# EAGLE design mainboard (EAGLE 9.6.2)
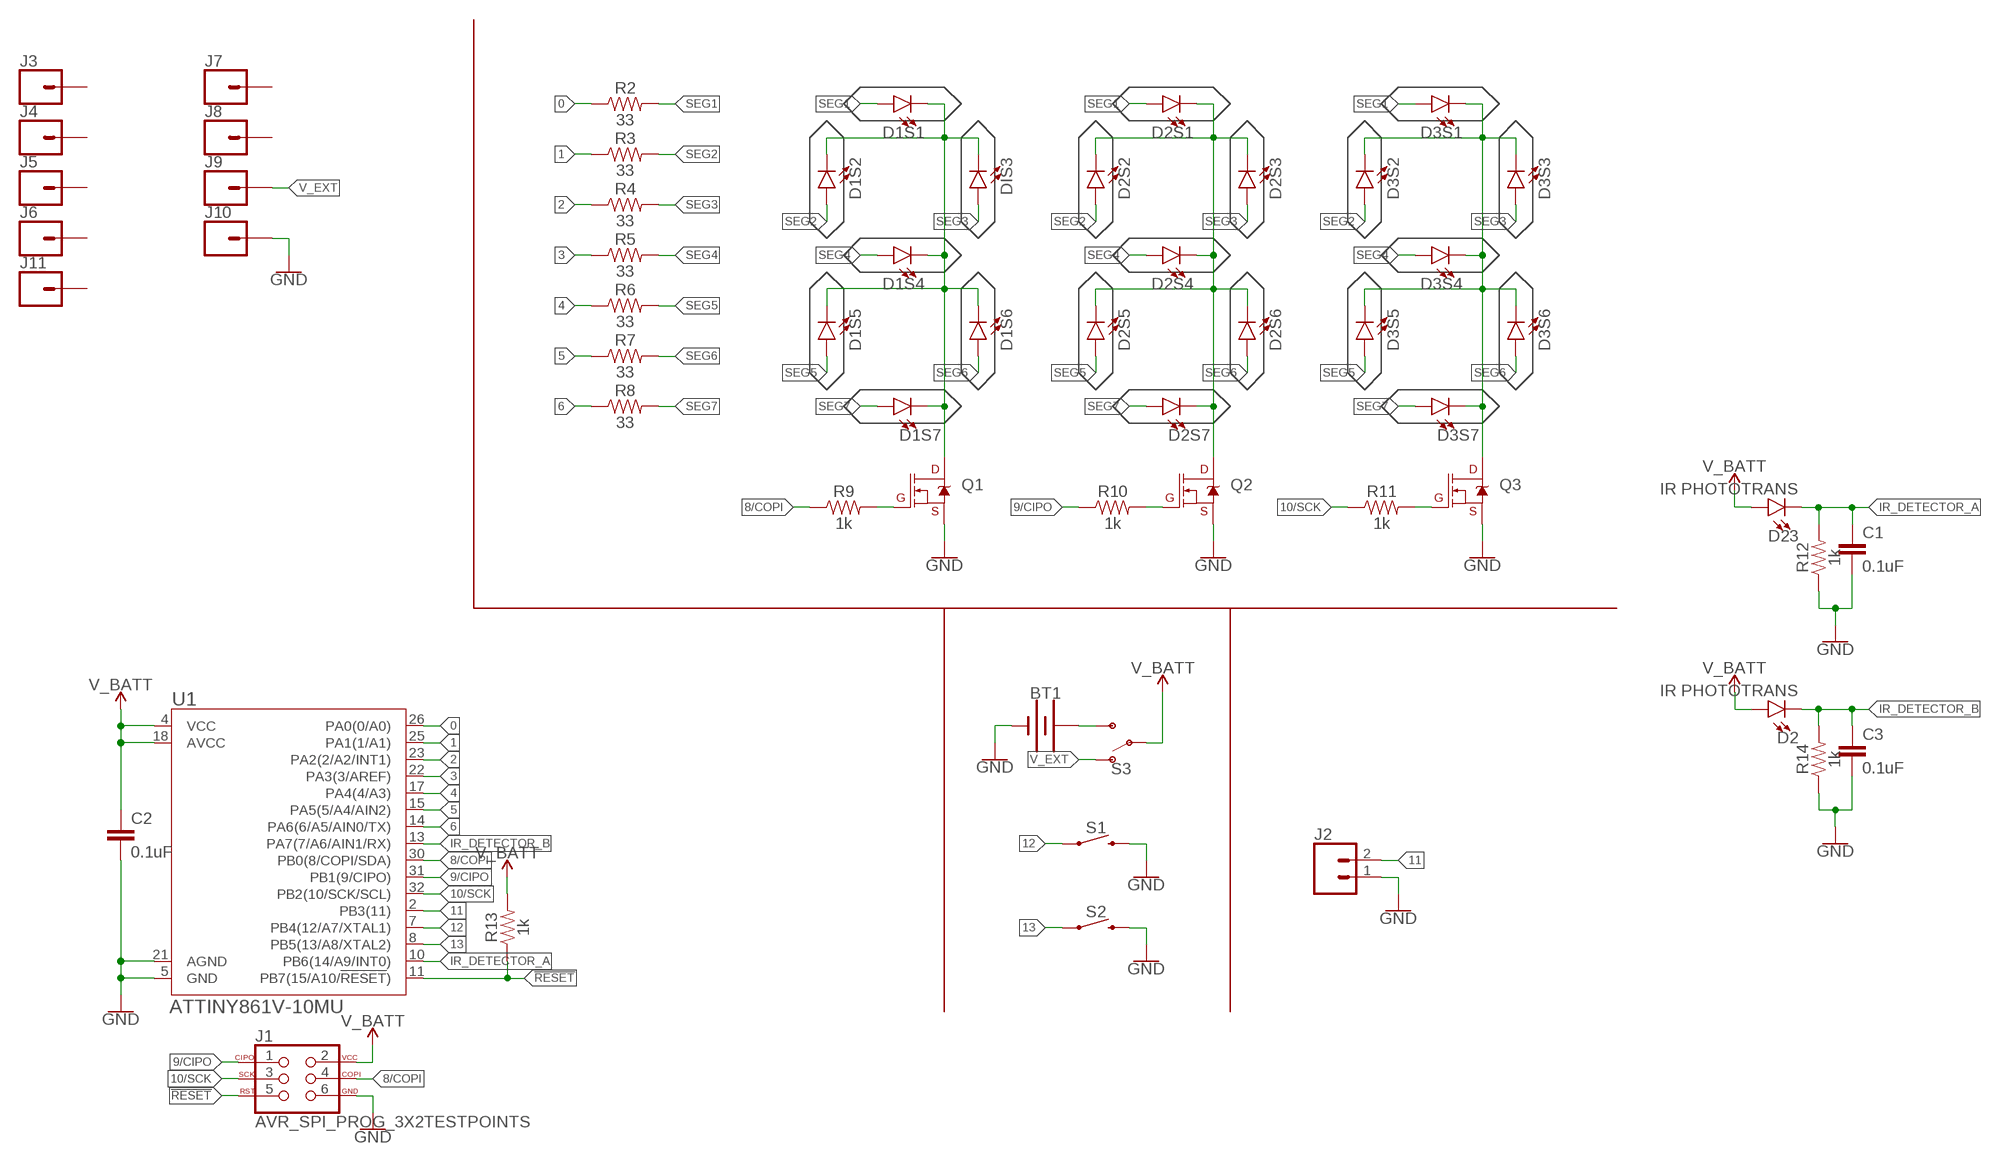
[diagram p0: schematic, sheet 1]

## Parts
BT1  BATTERY-20MM_SMD_4LEGS_OVERPASTE_INNER  [BATTCON_20MM_4LEGS_OVERPASTE_INNER]
C1  0.1uF  0.1UF-0603-25V-(+80/-20%)  [0603]
C2  0.1uF  0.1UF-0603-25V-(+80/-20%)  [0603]
C3  0.1uF  0.1UF-0603-25V-(+80/-20%)  [0603]
D1S1  LED0603  [LED-0603]
D1S2  LED0603  [LED-0603]
D1S4  LED0603  [LED-0603]
D1S5  LED0603  [LED-0603]
D1S6  LED0603  [LED-0603]
D1S7  LED0603  [LED-0603]
D2  IR PHOTOTRANS  LED-IR0603  [LED-0603]
D2S1  LED0603  [LED-0603]
D2S2  LED0603  [LED-0603]
D2S3  LED0603  [LED-0603]
D2S4  LED0603  [LED-0603]
D2S5  LED0603  [LED-0603]
D2S6  LED0603  [LED-0603]
D2S7  LED0603  [LED-0603]
D3S1  LED0603  [LED-0603]
D3S2  LED0603  [LED-0603]
D3S3  LED0603  [LED-0603]
D3S4  LED0603  [LED-0603]
D3S5  LED0603  [LED-0603]
D3S6  LED0603  [LED-0603]
D3S7  LED0603  [LED-0603]
D23  IR PHOTOTRANS  LED-IR0603  [LED-0603]
DIS3  LED0603  [LED-0603]
J1  AVR_SPI_PROG_3X2TESTPOINTS  [2X3_TEST_POINTS]
J2  CONN_02  [1X02]
J3  CONN_01  [1X01]
J4  CONN_01  [1X01]
J5  CONN_01  [1X01]
J6  CONN_01  [1X01]
J7  CONN_01  [1X01]
J8  CONN_01  [1X01]
J9  CONN_01  [1X01]
J10  CONN_01  [1X01]
J11  CONN_01  [1X01]
Q1  220mA/50V/3.5Ω  MOSFET-NCH-BSS138  [SOT23-3]
Q2  220mA/50V/3.5Ω  MOSFET-NCH-BSS138  [SOT23-3]
Q3  220mA/50V/3.5Ω  MOSFET-NCH-BSS138  [SOT23-3]
R2  33  33OHM-0603-1/10W-1%  [0603]
R3  33  33OHM-0603-1/10W-1%  [0603]
R4  33  33OHM-0603-1/10W-1%  [0603]
R5  33  33OHM-0603-1/10W-1%  [0603]
R6  33  33OHM-0603-1/10W-1%  [0603]
R7  33  33OHM-0603-1/10W-1%  [0603]
R8  33  33OHM-0603-1/10W-1%  [0603]
R9  1k  1KOHM-0603-1/10W-1%  [0603]
R10  1k  1KOHM-0603-1/10W-1%  [0603]
R11  1k  1KOHM-0603-1/10W-1%  [0603]
R12  1k  1KOHM-0603-1/10W-1%  [0603]
R13  1k  1KOHM-0603-1/10W-1%  [0603]
R14  1k  1KOHM-0603-1/10W-1%  [0603]
S1  MOMENTARY-SWITCH-SPST-SMD-5.2MM-TALL  [TACTILE_SWITCH_SMD_5.2MM]
S2  MOMENTARY-SWITCH-SPST-SMD-5.2MM-TALL  [TACTILE_SWITCH_SMD_5.2MM]
S3  SWITCH-SPDT-SMD-RIGHT-ANGLE  [SWITCH_SPST_SMD_A]
U1  ATTINY861V-10MU  [32M1-A_ATM]

## Nets
0: R2.1 U1.26(PA0(0/A0))
1: R3.1 U1.25(PA1(1/A1))
2: R4.1 U1.23(PA2(2/A2/INT1))
3: R5.1 U1.22(PA3(3/AREF))
4: R6.1 U1.17(PA4(4/A3))
5: R7.1 U1.15(PA5(5/A4/AIN2))
6: R8.1 U1.14(PA6(6/A5/AIN0/TX))
8/COPI: J1.4 R9.1 U1.30(PB0(8/COPI/SDA))
9/CIPO: J1.1 R10.1 U1.31(PB1(9/CIPO))
10/SCK: J1.3 R11.1 U1.32(PB2(10/SCK/SCL))
11: J2.2 U1.2(PB3(11))
12: S1.1 U1.7(PB4(12/A7/XTAL1))
13: S2.1 U1.8(PB5(13/A8/XTAL2))
!RESET: J1.5 R13.1 U1.11(PB7(15/A10/!RESET!))
GND: BT1.2(-) C1.2 C2.2 C3.2 J1.6 J2.1 J10.1 Q1.2(S) Q2.2(S) Q3.2(S) R12.1 R14.1 S1.3 S2.3 U1.5(GND) U1.21(AGND)
IR_DETECTOR_A: C1.1 D23.C R12.2 U1.10(PB6(14/A9/INT0))
IR_DETECTOR_B: C3.1 D2.C R14.2 U1.13(PA7(7/A6/AIN1/RX))
N$1: BT1.1(+) S3.3(S)
N$4: D1S1.C D1S2.C D1S4.C D1S5.C D1S6.C D1S7.C DIS3.C Q1.3(D)
N$8: Q2.1(G) R10.2
N$9: Q1.1(G) R9.2
N$11: D2S1.C D2S2.C D2S3.C D2S4.C D2S5.C D2S6.C D2S7.C Q2.3(D)
N$13: Q3.1(G) R11.2
N$14: D3S1.C D3S2.C D3S3.C D3S4.C D3S5.C D3S6.C D3S7.C Q3.3(D)
SEG1: D1S1.A D2S1.A D3S1.A R2.2
SEG2: D1S2.A D2S2.A D3S2.A R3.2
SEG3: D2S3.A D3S3.A DIS3.A R4.2
SEG4: D1S4.A D2S4.A D3S4.A R5.2
SEG5: D1S5.A D2S5.A D3S5.A R6.2
SEG6: D1S6.A D2S6.A D3S6.A R7.2
SEG7: D1S7.A D2S7.A D3S7.A R8.2
V_BATT: C2.1 D2.A D23.A J1.2 R13.2 S3.2(P) U1.4(VCC) U1.18(AVCC)
V_EXT: J9.1 S3.1(O)
Unconnected: J3.1 J4.1 J5.1 J6.1 J7.1 J8.1 J11.1

## Library data of the parts
BT1 = SparkFun-Batteries:BATTERY: Battery - Single Cell A variety of battery chemistries, sizes, and footprints. Device List: 20MM_PTH - Coin Cell Battery Holder - 20mm (PTH) <https://www.sparkfun.com/products/783> 20MM_PTH_KIT- Coin Cell battery Holder - 20 mm (PTH) <http://www.sparkfun.com/products/783>kit version with special mask 6.8MM_PTH - Coin Cell Battery Holder - 6.8MM(SMD) <https://www.digikey.com/product-detail/en/seiko-instruments/MS621FE-FL11E/728-1057-ND/1889208?WT.srch=1&gclid=CNOQ5a6LzdQCFZS2wAodXCkE0g> 12MM_SMD - Coin Cell Battery Holder - 12mm (SMD) <https://www.sparkfun.com/products/10592> 12MM_PTH - Coin Cell Battery Holder - 12mm (PTH) <https://www.sparkfun.com/products/7948> 20MM_SMD - 20mm Coin Cell Battery Holder (SMD) (2 legs) Used on the Big Time Watch Kit <https://www.sparkfun.com/products/11734> 20MM_SMD_4LEGS - Coin Cell Battery Holder - 20mm (SMD) <https://www.sparkfun.com/products/11892> 20MM_SMD_4LEGS_OVERPASTE - Coin Cell Battery Holder - 20mm (SMD) <https://www.sparkfun.com/products/11892> (Over-paste on the legs) 24.5MM_PTH - Coin Cell Battery Holder - 24.5mm (PTH) <https://www.sparkfun.com/products/8863> 9V - 9V Battery Holder - PC Mount Used on the SparkFun SparkPunk Sound Kit <https://www.sparkfun.com/products/11177> and SparkFun SparkPunk Sequencer Kit <https://www.sparkfun.com/products/12707> 18650 - Battery Holder - 18650 (PTH) <https://www.sparkfun.com/products/13113> AA - Battery Holder - 1xAA (PTH) <https://www.sparkfun.com/products/7949> AAA - Battery Holder - 1xAAA (PTH) <https://www.sparkfun.com/products/12718> AA_KIT - Battery Holder - 1xAA (PTH) <https://www.sparkfun.com/products/7949> Special kit package - pads only have exposed copper on one side of the board. AAA_KIT - Battery Holder - 1xAAA (PTH) <https://www.sparkfun.com/products/12718> Special kit package - pads only have exposed copper on one side of the board.
C1-C3 = SparkFun-Capacitors:0.1UF: 0.1µF ceramic capacitors A capacitor is a passive two-terminal electrical component used to store electrical energy temporarily in an electric field.; PROD_ID: CAP-00810
D1S1 D1S2 D1S4-D1S7 D2S1-D2S7 D3S1-D3S7 DIS3 = SparkFun-LED:LED: LED (Generic) Standard schematic elements and footprints for 5mm, 3mm, 1206, and 0603 sized LEDs. Generic LEDs with no color specified.
D2 D23 = SparkFun-LED:LED-IR: Infrared LED (IR) Wavelength: 940nm Packages: TSAL6100 LTE302 - Side firing. Check SparkFun-Sensors.lbr for the receiver SparkFun Products: ZX Distance and Gesture Sensor <[https://www.sparkfun.com/products/12780]> Infrared Emitters and Detectors <https://www.sparkfun.com/products/241>; PROD_ID: DIO-14125
J1 = SparkFun-Connectors:AVR_SPI_PROG_3X2: AVR ISP 6 Pin This is the reduced ISP connector for AVR programming. Common on Arduino. This footprint will take up less PCB space and can be used with a 10-pin to 6-pin adapter such as SKU: BOB-08508 **Special note about "TEST_POINT" package. The stop mask is on the top side, so if you want your programming test points to be on the bottom of your board, make sure to place this package on the bottom side of the board. This also ensure that the orientation to program from the bottom side will be correct. SparkFun Products: SparkFun ISP Pogo Adapter <https://www.sparkfun.com/products/11591> - NS Tiny AVR Programmer <https://www.sparkfun.com/products/11801> -PTH
J2 = SparkFun-Connectors:CONN_02: Multi connection point. Often used as Generic Header-pin footprint for 0.1 inch spaced/style header connections On any of the 0.1 inch spaced packages, you can populate with these: Break Away Headers - Straight <https://www.sparkfun.com/products/116> (PRT-00116) Break Away Male Headers - Right Angle <https://www.sparkfun.com/products/553> (PRT-00553) Female Headers <https://www.sparkfun.com/products/115> (PRT-00115) Break Away Headers - Machine Pin <https://www.sparkfun.com/products/117> (PRT-00117) Break Away Female Headers - Swiss Machine Pin <https://www.sparkfun.com/products/743> (PRT-00743) For SCREWTERMINALS and SPRING TERMINALS visit here: Screw Terimnals on SparkFun.com <https://www.sparkfun.com/search/results?term=Screw+Terminals> (5mm/3.5mm/2.54mm spacing) This device is also useful as a general connection point to wire up your design to another part of your project. Our various solder wires solder well into these plated through hole pads. Hook-Up Wire - Assortment (Stranded, 22 AWG) <https://www.sparkfun.com/products/11375> (PRT-11375) Hook-Up Wire - Assortment (Solid Core, 22 AWG) <https://www.sparkfun.com/products/11367> (PRT-11367) View the entire wire category on our website here <https://www.sparkfun.com/categories/141> Special notes: Molex polarized connector foot print use with: PRT-08233 with associated crimp pins and housings. 2.54_SCREWTERM for use with PRT-10571. 3.5mm Screw Terminal footprints for PRT-08084 5mm Screw Terminal footprints for use with PRT-08432
J3-J11 = SparkFun-Connectors:CONN_01: Single connection point. Often used as Generic Header-pin footprint for 0.1 inch spaced/style header connections On any of the 0.1 inch spaced packages, you can populate with these: Break Away Headers - Straight <https://www.sparkfun.com/products/116> (PRT-00116) Break Away Male Headers - Right Angle <https://www.sparkfun.com/products/553> (PRT-00553) Female Headers <https://www.sparkfun.com/products/115> (PRT-00115) Break Away Headers - Machine Pin <https://www.sparkfun.com/products/117> (PRT-00117) Break Away Female Headers - Swiss Machine Pin <https://www.sparkfun.com/products/743> (PRT-00743) This device is also useful as a general connection point to wire up your design to another part of your project. Our various solder wires solder well into these plated through hole pads. Hook-Up Wire - Assortment (Stranded, 22 AWG) <https://www.sparkfun.com/products/11375> (PRT-11375) Hook-Up Wire - Assortment (Solid Core, 22 AWG) <https://www.sparkfun.com/products/11367> (PRT-11367) View the entire wire category on our website here <https://www.sparkfun.com/categories/141> Special notes: SMTSO-256-ET is a "flush mount" nut for a 4-40 screw. We mostly use this on specialty testbeds; it is a nice way to connect hardware to your PCB at an adjustable hieght. Also note, the SNAP packages are for using a snappable style connector. We sell a baggie of snaps and they are also used on two LilyPad designs: Snap Assortment - 30 pack (male and female) <https://www.sparkfun.com/products/11347> (DEV-11347) LilyPad Arduino SimpleSnap <https://www.sparkfun.com/products/10941> (DEV-10941) LilyPad SimpleSnap Protoboard <https://www.sparkfun.com/products/10940> (DEV-10940)
Q1-Q3 = SparkFun-DiscreteSemi:MOSFET-NCH: N-channel MOSFETs Voltage controlled devices that allow control of high current outputs. SparkFun Products: SparkFun OpenScale <https://www.sparkfun.com/products/13261> SparkFun Digital Sandbox <https://www.sparkfun.com/products/12651> SparkFun Monster Moto Shield <https://www.sparkfun.com/products/10182> SparkFun MOSFET Power Controller <https://www.sparkfun.com/products/11214>; PROD_ID: TRANS-00830
R2-R8 = SparkFun-Resistors:33OHM: 33Ω resistor A resistor is a passive two-terminal electrical component that implements electrical resistance as a circuit element. Resistors act to reduce current flow, and, at the same time, act to lower voltage levels within circuits. - Wikipedia; PROD_ID: RES-08270
R9-R14 = SparkFun-Resistors:1KOHM: 1kΩ resistor A resistor is a passive two-terminal electrical component that implements electrical resistance as a circuit element. Resistors act to reduce current flow, and, at the same time, act to lower voltage levels within circuits. - Wikipedia; PROD_ID: RES-07856
S1 S2 = SparkFun-Switches:MOMENTARY-SWITCH-SPST: Momentary Switch (Pushbutton) - SPST Normally-open (NO) SPST momentary switches (buttons, pushbuttons). Variants PTH-12MM - 12mm square, through-hole Momentary Pushbutton Switch - 12mm Square <https://www.sparkfun.com/products/9190> (COM-09190) PTH-6.0MM, PTH-6.0MM-KIT - 6.0mm square, through-hole Mini Pushbutton Switch <https://www.sparkfun.com/products/97> (COM-00097) KIT package intended for soldering kit's - only one side of pads' copper is exposed. PTH-RIGHT-ANGLE-KIT - Right-angle, through-hole Right Angle Tactile Button <https://www.sparkfun.com/products/10791> - Used on SparkFun BigTime Watch Kit <https://www.sparkfun.com/products/11734> SMD-12MM - 12mm square, surface-mount Tactile Button - SMD (12mm) <https://www.sparkfun.com/products/12993> (COM-12993) Used on SparkFun PicoBoard <https://www.sparkfun.com/products/11888> SMD-4.5MM - 4.5mm Square Trackball Switch Used on SparkFun Blackberry Trackballer Breakout <https://www.sparkfun.com/products/13169> SMD-4.6MMX2.8MM - 4.60mm x 2.80mm, surface mount Used on SparkFun Pro Micro - RP2040 <https://www.sparkfun.com/products/17717> SMD-5.2MM, SMD-5.2-REDUNDANT - 5.2mm square, surface-mount Mini Pushbutton Switch - SMD <https://www.sparkfun.com/products/8720> (COM-08720) Used on Arduino Pro Mini <https://www.sparkfun.com/products/11114> REDUNDANT package connects both switch circuits together SMD-6.0X3.5MM - 6.0 x 3.5mm, surface mount Momentary Reset Switch SMD <https://www.sparkfun.com/products/8229> (COM-08229) SMD-6.2MM-TALL - 6.2mm square, surface mount Tactile Button - SMD (6mm) <https://www.sparkfun.com/products/12992> Used on SparkFun Digital Sandbox <https://www.sparkfun.com/products/12651> SMD-RIGHT-ANGLE - Right-angle, surface mount Used on SparkFun Block for Intel® Edison - Arduino <https://www.sparkfun.com/products/13036>; PROD_ID: SWCH-14139
S3 = SparkFun-Switches:SWITCH-SPDT: Single Pole, Double Throw (SPDT) Switch Single-pole, double-throw (SPDT) switch. Variant Overview SMD-AYZ0202 Surface Mount DPDT Switch <https://www.sparkfun.com/products/597> (COM-00597) Used on e.g. LilyPad Arduino USB - ATmega32U4 Board <https://www.sparkfun.com/products/12049> PTH-11.6X4.0MM SPDT Mini Power Switch <https://www.sparkfun.com/products/102> (COM-00102) Used on e.g. SparkFun Simon Says - Through-Hole Soldering Kit <https://www.sparkfun.com/products/10547> (KIT-10547) PTH-11.6X4.0MM-KIT KIT version of SPDT Mini Power Switch - Simplifies soldering by removing tStop of switch pins - only one side can be soldered. PTH-11.6X4.0MM-LOCK LOCK version of SPDT Mini Power Switch - Offset pins hold switch in place for easier soldering. SMD-RIGHT-ANGLE Surface Mount Right Angle Switch <https://www.sparkfun.com/products/10860> (COM-10860) Used on e.g. SparkFun ESP8266 Thing <https://www.sparkfun.com/products/13231>; PROD_ID: SWCH-10651; SF_SKU: COM-10860
U1 = Melodica:ATTINY861V-10MU; COPYRIGHT: Copyright (C) 2021 Ultra Librarian. All rights reserved.; DIGI-KEY_PART_NUMBER_1: ATTINY861V-10MU-ND; DIGI-KEY_PART_NUMBER_2: 2156-ATTINY861V-10MU-ND; MANUFACTURER_PART_NUMBER: ATTINY861V-10MU; MFR_NAME: Microchip

## Board
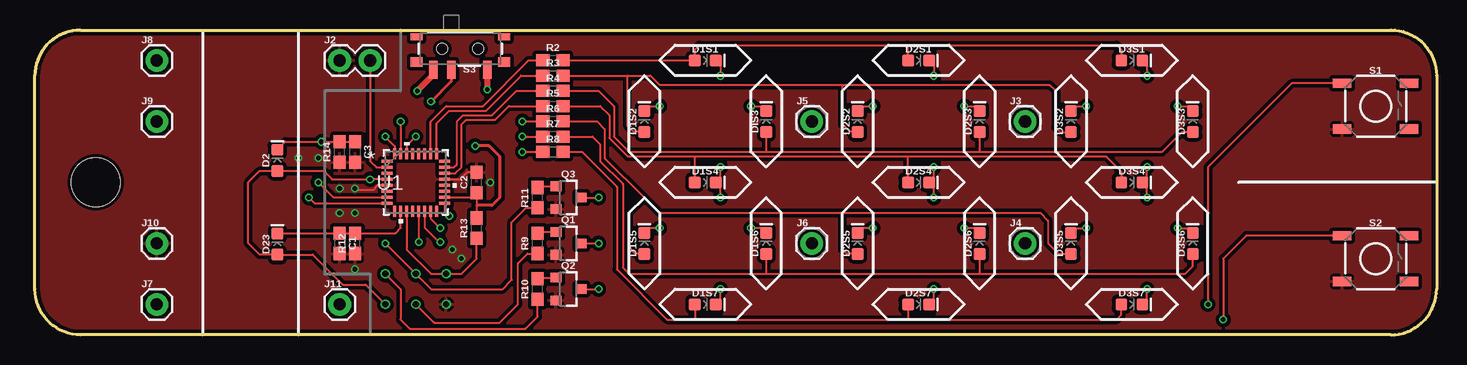
[diagram p1: board, top side]
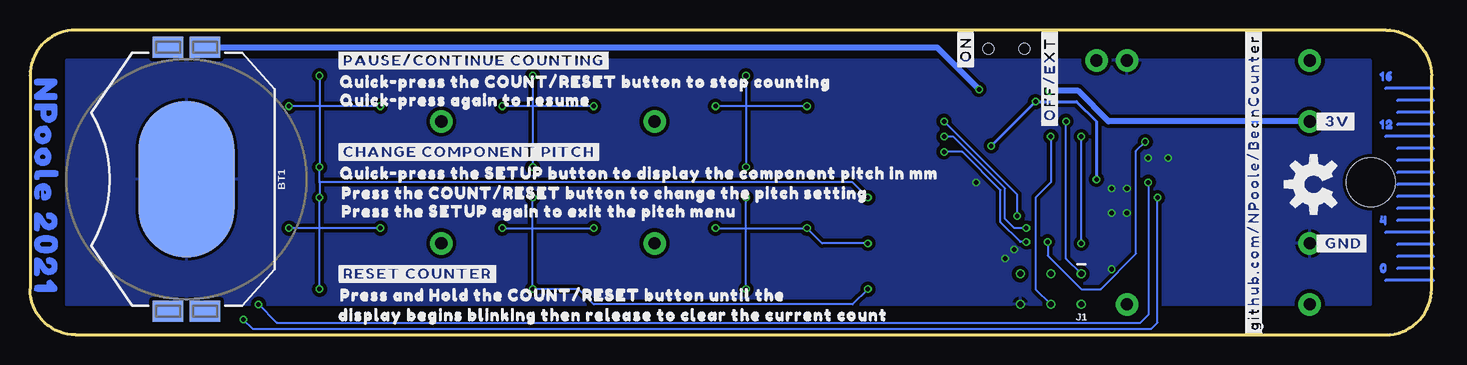
[diagram p2: board, bottom side, seen from below]

Size 116.84 x 25.4 mm. Coordinates in mm from the lower left corner, seen from the top.
Outline: 3.81,25.4 113.03,25.4 arc-90 116.84,21.59 116.84,3.81 arc-90 113.03,0 3.81,0 arc-90 0,3.81 0,21.59 arc-90 3.81,25.4
Copper layers (1*16): Top 0.035mm / dielectric 30mil / Bottom 0.035mm
Design rules "SparkFun-2-Layer-Minimum-JLCPCB *": minimum track width 5mil, minimum drill 0.3mm, track to track 5mil, track to pad 5mil, pad to pad 5mil, via to via 5mil, smd to smd 5mil, copper to edge 7mil, drill to drill 7mil, minimum pad ring 5mil, minimum via ring 5mil, stop-mask expansion 4mil, vias tented up to drill 25mil, thermal gap 10mil
Holes 4.06 mm at 5.08,12.7

### Footprints (pad centres in the part's own frame; a part is rotated, then mirrored left to right if it is on the bottom)
BATTCON_20MM_4LEGS_OVERPASTE_INNER = smd 1.778 x 2.54: 1 -11,1.55; 3 11,1.55; P$1 -11,-1.55; P$2 11,-1.55 | smd 13 x 8: 2 0,0
0603 = smd 1.1 x 1: 1 -0.85,0; 2 0.85,0
LED-0603 = smd 1 x 1: A -0.877,0; C 0.877,0
2X3_TEST_POINTS = drill 0.508: 1 -2.54,-1.27; 2 -2.54,1.27; 3 0,-1.27; 4 0,1.27; 5 2.54,-1.27; 6 2.54,1.27
1X02 = drill 1.016 pad 1.88: 1 0,0; 2 2.54,0
1X01 = drill 1.016 pad 1.88: 1 0,0
SOT23-3 = smd 0.8 x 0.9: 1 -0.95,-1; 2 0.95,-1; 3 0,1.1
TACTILE_SWITCH_SMD_5.2MM = smd 1.524 x 0.762: 1 -2.794,1.905; 2 2.794,1.905; 3 -2.794,-1.905; 4 2.794,-1.905
SWITCH_SPST_SMD_A = smd 0.7 x 1.5: 1 -2.25,-1.75; 2 -0.75,-1.75; 3 2.25,-1.75 | smd 1 x 0.6: GND1 -3.65,1; GND3 3.65,1 | smd 1 x 0.8: GND2 -3.65,-1.1; GND4 3.65,-1.1 | hole 0.9: -1.5,0; 1.5,0
32M1-A_ATM = smd 0.914 x 0.254: 1 -2.4,1.75; 2 -2.4,1.25; 3 -2.4,0.75; 4 -2.4,0.25; 5 -2.4,-0.25; 6 -2.4,-0.75; 7 -2.4,-1.25; 8 -2.4,-1.75; 17 2.4,-1.75; 18 2.4,-1.25; 19 2.4,-0.75; 20 2.4,-0.25; 21 2.4,0.25; 22 2.4,0.75; 23 2.4,1.25; 24 2.4,1.75 | smd 0.254 x 0.914: 9 -1.75,-2.4; 10 -1.25,-2.4; 11 -0.75,-2.4; 12 -0.25,-2.4; 13 0.25,-2.4; 14 0.75,-2.4; 15 1.25,-2.4; 16 1.75,-2.4; 25 1.75,2.4; 26 1.25,2.4; 27 0.75,2.4; 28 0.25,2.4; 29 -0.25,2.4; 30 -0.75,2.4; 31 -1.25,2.4; 32 -1.75,2.4

### Placement (x,y rotation side)
BT1  103.79,12.96 270 bottom
C1  25.4,7.62 270 top
C2  36.83,12.7 90 top
C3  26.67,15.24 270 top
D1S1  55.88,22.86 0 top
D1S2  50.8,17.78 90 top
D1S4  55.88,12.7 0 top
D1S5  50.8,7.62 90 top
D1S6  60.96,7.62 90 top
D1S7  55.88,2.54 0 top
D2  20.2,14.54 90 top
D2S1  73.66,22.86 0 top
D2S2  68.58,17.78 90 top
D2S3  78.74,17.78 90 top
D2S4  73.66,12.7 0 top
D2S5  68.58,7.62 90 top
D2S6  78.74,7.62 90 top
D2S7  73.66,2.54 0 top
D3S1  91.44,22.86 0 top
D3S2  86.36,17.78 90 top
D3S3  96.52,17.78 90 top
D3S4  91.44,12.7 0 top
D3S5  86.36,7.62 90 top
D3S6  96.52,7.62 90 top
D3S7  91.44,2.54 0 top
D23  20.21,7.56 90 top
DIS3  60.96,17.78 90 top
J1  31.75,3.81 180 bottom
J2  25.4,22.86 0 top
J3  82.55,17.78 0 top
J4  82.55,7.62 0 top
J5  64.77,17.78 0 top
J6  64.77,7.62 0 top
J7  10.16,2.54 0 top
J8  10.16,22.86 0 top
J9  10.16,17.78 0 top
J10  10.16,7.62 0 top
J11  25.4,2.54 0 top
Q1  44.45,7.62 270 top
Q2  44.45,3.81 270 top
Q3  44.45,11.43 270 top
R2  43.18,22.86 0 top
R3  43.18,21.59 0 top
R4  43.18,20.32 0 top
R5  43.18,19.05 0 top
R6  43.18,17.78 0 top
R7  43.18,16.51 0 top
R8  43.18,15.24 0 top
R9  41.91,7.62 90 top
R10  41.91,3.81 90 top
R11  41.91,11.43 90 top
R12  26.67,7.62 90 top
R13  36.83,8.89 90 top
R14  25.4,15.24 90 top
S1  111.76,19.05 0 top
S2  111.76,6.35 0 top
S3  35.46,23.83 0 top
U1  31.75,12.7 0 top
U$5  [00]  4.84,5.54 0 bottom
U$6  [#_3V#0]  9.91,17.78 0 bottom
U$7  [#_GND#0]  9.91,7.62 0 bottom
U$8  [#PAUSE#CONTINUE_COUNTING#0]  91.44,22.86 0 bottom
U$9  [#RESET_COUNTER#0]  91.44,5.08 0 bottom
U$10  [#CHANGE_COMPONENT_PITCH#0]  91.44,15.24 0 bottom
U$11  [QUICK#PRESS_THE_COUNT#RESET_BUTTON_TO_STOP_COUNTING0]  91.69,21.08 0 bottom
U$12  [QUICK#PRESS_AGAIN_TO_RESUME0]  91.69,19.56 0 bottom
U$13  [PRESS_AND_HOLD_THE_COUNT#RESET_BUTTON_UNTIL_THE0]  91.69,3.3 0 bottom
U$14  [DISPLAY_BEGINS_BLINKING_THEN_RELEASE_TO_CLEAR_THE_CURRENT_COUNT0]  91.82,1.65 0 bottom
U$15  [QUICK#PRESS_THE_SETUP_BUTTON_TO_DISPLAY_THE_COMPONENT_PITCH_IN_MM0]  91.69,13.46 0 bottom
U$17  [PRESS_THE_SETUP_AGAIN_TO_EXIT_THE_PITCH_MENU0]  91.57,10.29 0 bottom
U$18  [#GITHUB#COM#NPOOLE#BEANCOUNTER#0]  14.84,-0.36 90 bottom
U$19  [OSHW-LOGO-M]  9.84,12.54 90 bottom
U$20  [40]  4.84,9.54 0 bottom
U$21  [120]  4.84,17.54 0 bottom
U$22  [160]  4.84,21.54 0 bottom
U$23  [#ON#0]  38.84,25.54 90 bottom
U$24  [#OFF#EXT#0]  31.84,25.54 90 bottom
U$25  [NPOOLE_20210]  115.54,22.74 270 bottom
U$26  [PRESS_THE_COUNT#RESET_BUTTON_TO_CHANGE_THE_PITCH_SETTING0]  91.57,11.81 0 bottom

### Tracks (layer width: path | path; a pad name or v marks a point on that pad's centre or on a via)
0
  Top 0.152: U1.26 33,17.76 34.29,19.05 37.34,19.05 41.15,22.86 R2.1
1
  Top 0.152: U1.25 33.5,17.62 34.54,18.67 37.59,18.67 40.51,21.59 R3.1
2
  Top 0.152: U1.23 34.91,13.95 35.18,14.22 35.18,17.78 35.69,18.29 38.1,18.29 40.13,20.32 R4.1
3
  Top 0.152: U1.22 35.04,13.45 35.56,13.97 35.56,17.53 35.94,17.91 38.35,17.91 39.5,19.05 R5.1
4  (via drill 0.38)
  Top 0.152: U1.17 34.15,10.3 v34.54,9.91 | v40.64,17.78 R6.1
  Bottom 0.152: v34.54,9.91 34.54,11.68 v40.64,17.78
5  (via drill 0.38)
  Top 0.152: U1.15 33,9.67 v33.78,8.89 | v40.64,16.51 R7.1
  Bottom 0.152: v33.78,8.89 34.8,8.89 35.56,9.65 35.56,12.19 39.88,16.51 v40.64,16.51
6  (via drill 0.38)
  Top 0.152: U1.14 32.5,8.9 33.66,7.75 v33.78,7.75 | v40.64,15.24 R8.1
  Bottom 0.152: v33.78,7.75 34.29,7.75 35.94,9.4 35.94,12.07 39.12,15.24 v40.64,15.24
8/COPI  (via drill 0.38)
  Top 0.152: v31.75,16.51 31,15.76 U1.30 | R9.1 41.06,6.77 40.26,5.97 40.26,2.54 38.73,1.02 33.27,1.02 J1.4
  Bottom 0.152: v31.75,16.51 31.75,12.7 33.02,11.43 33.02,3.81 J1.4
9/CIPO  (via drill 0.38)
  Top 0.152: v30.48,17.78 30.5,17.76 U1.31 | J1.1 30.48,3.81 30.48,1.27 31.24,0.51 40.89,0.51 41.91,1.52 R10.1
  Bottom 0.152: J1.1 30.48,6.35 v30.48,17.78
10/SCK  (via drill 0.38)
  Top 0.152: v29.21,7.62 J1.3 33.02,3.81 38.99,3.81 39.75,4.57 39.75,9.4 40.93,10.58 R11.1 | v29.21,16.51 30,15.72 U1.32
  Bottom 0.152: v29.21,7.62 v29.21,16.51
11
  Top 0.152: J2.2 27.94,14.48 28.47,13.95 U1.2
12  (via drill 0.38)
  Top 0.152: S1.1 104.78,20.95 97.79,13.97 v97.79,2.54 | v23.62,12.7 24.87,11.45 U1.7
  Bottom 0.152: v97.79,2.54 96.27,1.02 24.26,1.02 23.62,1.65 v23.62,12.7
13  (via drill 0.38)
  Top 0.152: S2.1 100.97,8.25 99.06,6.35 v99.06,1.27 | v22.85,11.43 23.33,10.95 U1.8
  Bottom 0.152: v99.06,1.27 98.3,0.51 23.37,0.51 22.86,1.02 v22.86,11.43 v22.85,11.43
!RESET
  Top 0.152: R13.1 36.83,6.35 35.56,5.08 J1.5 33.02,5.08 31,7.1 U1.11
GND  (via drill 0.38)
  Top 0.152: U1.21 34.92,12.95 | 34.92,12.95 | U1.5 28.57,12.45 28.19,12.07 26.8,12.07 v26.67,12.19 | 34.92,12.95 35.43,12.95 36.07,13.59 36.79,13.59 C2.2
  other vias: 25.4,10.16 26.67,10.16 26.67,5.46 37.97,12.7 34.8,7.11 35.56,6.35 21.97,14.73 23.62,14.73 25.4,12.19
  pour Top (isolate 0.305): 0,25.4 116.84,25.4 116.84,0 0,0
  pour Bottom (isolate 0.305): 5.08,22.86 113.84,22.86 113.84,2.54 5.08,2.54
IR_DETECTOR_A
  Top 0.152: D23.C 20.24,8.47 C1.1 R12.2 30.06,8.47 30.5,8.91 U1.10
IR_DETECTOR_B  (via drill 0.38)
  Top 0.152: D2.C 20.87,16.09 v23.88,16.09 R14.2 C3.1 | v32,7.75 U1.13
  Bottom 0.152: v32,7.75 32,6.6 29.21,3.81 27.59,3.81 24.64,6.76 24.64,15.33 v23.88,16.09
N$1  (via drill 0.38)
  Top 0.508: v37.72,20.45 S3.3
  Bottom 0.508: BT1.1 41.23,23.96 v37.72,20.45
N$2
  Bottom 0.254: -0.16,4.54 3.84,4.54
N$3
  Bottom 0.254: -0.16,5.54 2.84,5.54
N$4  (via drill 0.38)
  Top 0.152: D1S1.C 57.15,22.86 v57.15,21.59 | v57.15,11.43 57.15,12.7 D1S4.C 57.15,13.09 v57.15,13.97 | D1S7.C 57.15,2.54 v57.15,3.81 | D1S2.C 50.8,19.05 v52.07,19.05 | v59.69,19.05 60.96,19.05 DIS3.C | D1S6.C 60.96,8.89 v59.69,8.89 | v52.07,8.89 50.8,8.89 D1S5.C | Q1.3 v46.99,7.62
  Bottom 0.152: v57.15,21.59 57.15,19.05 | 57.15,19.05 v57.15,13.97 | v57.15,3.81 57.15,8.89 | 57.15,8.89 v57.15,11.43 | v52.07,19.05 57.15,19.05 | 57.15,19.05 v59.69,19.05 | v59.69,8.89 57.15,8.89 | 57.15,8.89 v52.07,8.89 50.8,7.62 v46.99,7.62
N$5
  Bottom 0.254: -0.16,6.54 2.84,6.54
N$6
  Bottom 0.254: -0.16,7.54 2.84,7.54
N$7
  Bottom 0.254: -0.16,8.54 3.84,8.54
N$8
  Top 0.152: R10.2 42.01,4.76 Q2.1
N$9
  Top 0.152: R9.2 42.01,8.57 Q1.1
N$10
  Bottom 0.254: -0.16,9.54 2.84,9.54
N$11  (via drill 0.38)
  Top 0.152: D2S1.C 74.93,22.86 v74.93,21.59 | v74.93,11.43 74.93,12.7 D2S4.C 74.93,13.09 v74.93,13.97 | D2S7.C 74.93,2.54 v74.93,3.81 | D2S6.C 78.74,8.89 v77.47,8.89 | v69.85,8.89 68.58,8.89 D2S5.C | D2S2.C 68.58,19.05 v69.85,19.05 | v77.47,19.05 78.74,19.05 D2S3.C | Q2.3 v46.99,3.81
  Bottom 0.152: v74.93,21.59 74.93,19.05 | 74.93,19.05 v74.93,13.97 | 74.93,8.89 v74.93,3.81 71.12,3.81 69.85,2.54 48.26,2.54 v46.99,3.81 | 74.93,8.89 v74.93,11.43 | 74.93,8.89 v69.85,8.89 | v69.85,19.05 74.93,19.05 | 74.93,19.05 v77.47,19.05 | v77.47,8.89 74.93,8.89
N$12
  Bottom 0.254: -0.16,10.54 2.84,10.54
N$13
  Top 0.152: R11.2 42.01,12.38 Q3.1
N$14  (via drill 0.38)
  Top 0.152: D3S1.C 92.71,22.86 v92.71,21.59 | v92.71,11.43 92.71,12.7 D3S4.C 92.71,13.09 v92.71,13.97 | D3S7.C 92.71,2.54 v92.71,3.81 | D3S5.C 86.36,8.89 v87.63,8.89 | v95.25,8.89 96.52,8.89 D3S6.C | D3S2.C 86.36,19.05 v87.63,19.05 | v95.25,19.05 96.52,19.05 D3S3.C | Q3.3 v46.99,11.43
  Bottom 0.152: v92.71,21.59 92.71,19.05 | 92.71,19.05 v92.71,13.97 92.71,12.7 | v92.71,3.81 92.71,8.89 | 92.71,8.89 v92.71,11.43 92.71,12.7 | v87.63,8.89 92.71,8.89 | 92.71,8.89 v95.25,8.89 | v87.63,19.05 92.71,19.05 | 92.71,19.05 v95.25,19.05 | v46.99,11.43 48.26,12.7 92.71,12.7
N$15
  Bottom 0.254: -0.16,11.54 2.84,11.54
N$16
  Bottom 0.254: -0.16,12.54 2.84,12.54
N$17
  Bottom 0.254: -0.16,13.54 2.84,13.54
N$18
  Bottom 0.254: -0.16,14.54 2.84,14.54
N$41
  Bottom 0.254: -0.16,15.54 2.84,15.54
N$42
  Bottom 0.254: -0.16,16.54 3.84,16.54
N$47
  Bottom 0.254: -0.16,17.54 2.84,17.54
N$48
  Bottom 0.254: -0.16,18.54 2.84,18.54
N$49
  Bottom 0.254: -0.16,19.54 2.84,19.54
N$50
  Bottom 0.254: -0.16,20.54 3.84,20.54
SEG1
  Top 0.152: R2.2 D1S1.A 55,23.76 55.37,24.13 72.77,24.13 | 72.77,24.13 90.17,24.13 90.56,23.74 D3S1.A | D2S1.A 72.78,24.12 72.77,24.13
SEG2
  Top 0.152: R3.2 49.4,21.59 | 49.4,21.59 51.31,21.59 52.07,20.83 67.44,20.83 | 67.44,20.83 84.58,20.83 85.09,20.32 85.09,17.27 85.47,16.89 86.35,16.89 D3S2.A | D1S2.A 49.9,16.9 49.4,17.4 49.4,21.59 | D2S2.A 67.93,16.9 67.31,17.53 67.31,20.7 67.44,20.83
SEG3
  Top 0.152: R4.2 46.99,20.32 48.26,19.05 48.26,16.51 49.53,15.24 60.96,15.24 | 60.96,15.24 78.74,15.24 | 78.74,15.24 93.98,15.24 95.64,16.9 D3S3.A | DIS3.A 60.96,15.24 | D2S3.A 78.74,15.24
SEG4
  Top 0.152: 54.99,14.86 49.4,14.86 47.88,16.38 47.88,18.29 47.12,19.05 R5.2 | 54.99,14.86 72.77,14.86 | 72.77,14.86 89.28,14.86 90.56,13.58 D3S4.A | D2S4.A 72.78,14.85 72.77,14.86 | D1S4.A 55,14.85 54.99,14.86
SEG5
  Top 0.152: R6.2 46.86,17.78 47.5,17.14 47.5,14.73 50.8,11.43 | 67.31,10.16 52.07,10.16 50.8,11.43 | 67.31,10.16 83.82,10.16 84.45,9.53 84.45,7.62 85.33,6.74 D3S5.A | D2S5.A 67.68,6.74 67.31,7.11 67.31,10.16 | D1S5.A 50.03,6.74 49.53,7.24 49.53,10.16 50.8,11.43
SEG6
  Top 0.152: R7.2 46.48,16.51 47.12,15.88 47.12,14.48 49.02,12.57 49.02,5.59 49.53,5.08 60.96,5.08 | 60.96,5.08 78.74,5.08 | 78.74,5.08 95.89,5.08 96.52,5.71 D3S6.A | D2S6.A 78.74,5.08 | D1S6.A 60.96,5.08
SEG7
  Top 0.152: R8.2 45.59,15.24 48.51,12.32 48.51,5.46 52.7,1.27 54.99,1.27 | 54.99,1.27 72.77,1.27 | 72.77,1.27 90.17,1.27 90.56,1.66 D3S7.A | D2S7.A 72.78,1.28 72.77,1.27 | D1S7.A 55,1.28 54.99,1.27
V_BATT  (via drill 0.38)
  Top 0.152: U1.18 36.43,11.45 C2.1 36.83,10.8 R13.2 | U1.4 v27.94,12.95 | v27.94,12.95 | J1.2 27.56,4.19 25.65,4.19 23.16,6.68 D23.A 18.72,6.68 17.78,7.62 17.78,12.7 18.74,13.66 D2.A 24.06,13.66 24.77,12.95 v27.94,12.95
  Top 0.254: v36.7,15.75 37.85,15.75 38.73,14.86 38.73,11.43 38.1,10.8 36.83,10.8 | S3.2 34.71,21.12 v33.02,19.43
  Bottom 0.254: v36.7,15.75 v33.02,19.43 29.59,19.43 27.94,17.78 v27.94,12.95
V_EXT  (via drill 0.38)
  Top 0.508: v31.88,20.32 33.21,21.65 S3.1
  Bottom 0.508: J9.1 26.92,17.78 29.46,20.32 v31.88,20.32